# Altium schematic sheet EEM_connector_Magneto.SchDoc: EEM connector
size 420 x 297 mm; Author: G.Kasprowicz; CompanyName: WUT ISE; DrawnBy: G.Kasprowicz; Organization: WUT ISE; Address1: PW ISE; Address2: Nowowiejska 15/19 00-665 Warsaw; Address3: gkasprow@gmail.com; DocumentNumber: 3; Revision: 2; SheetNumber: 3; SheetTotal: 7; ModifiedBy: -; CheckedDate: -; Title2: & LVDS circuit; DivGrp: WUT ISE; Designer: G.Kasprowicz; ModifiedDate: -; ProjectName: Sensor Box
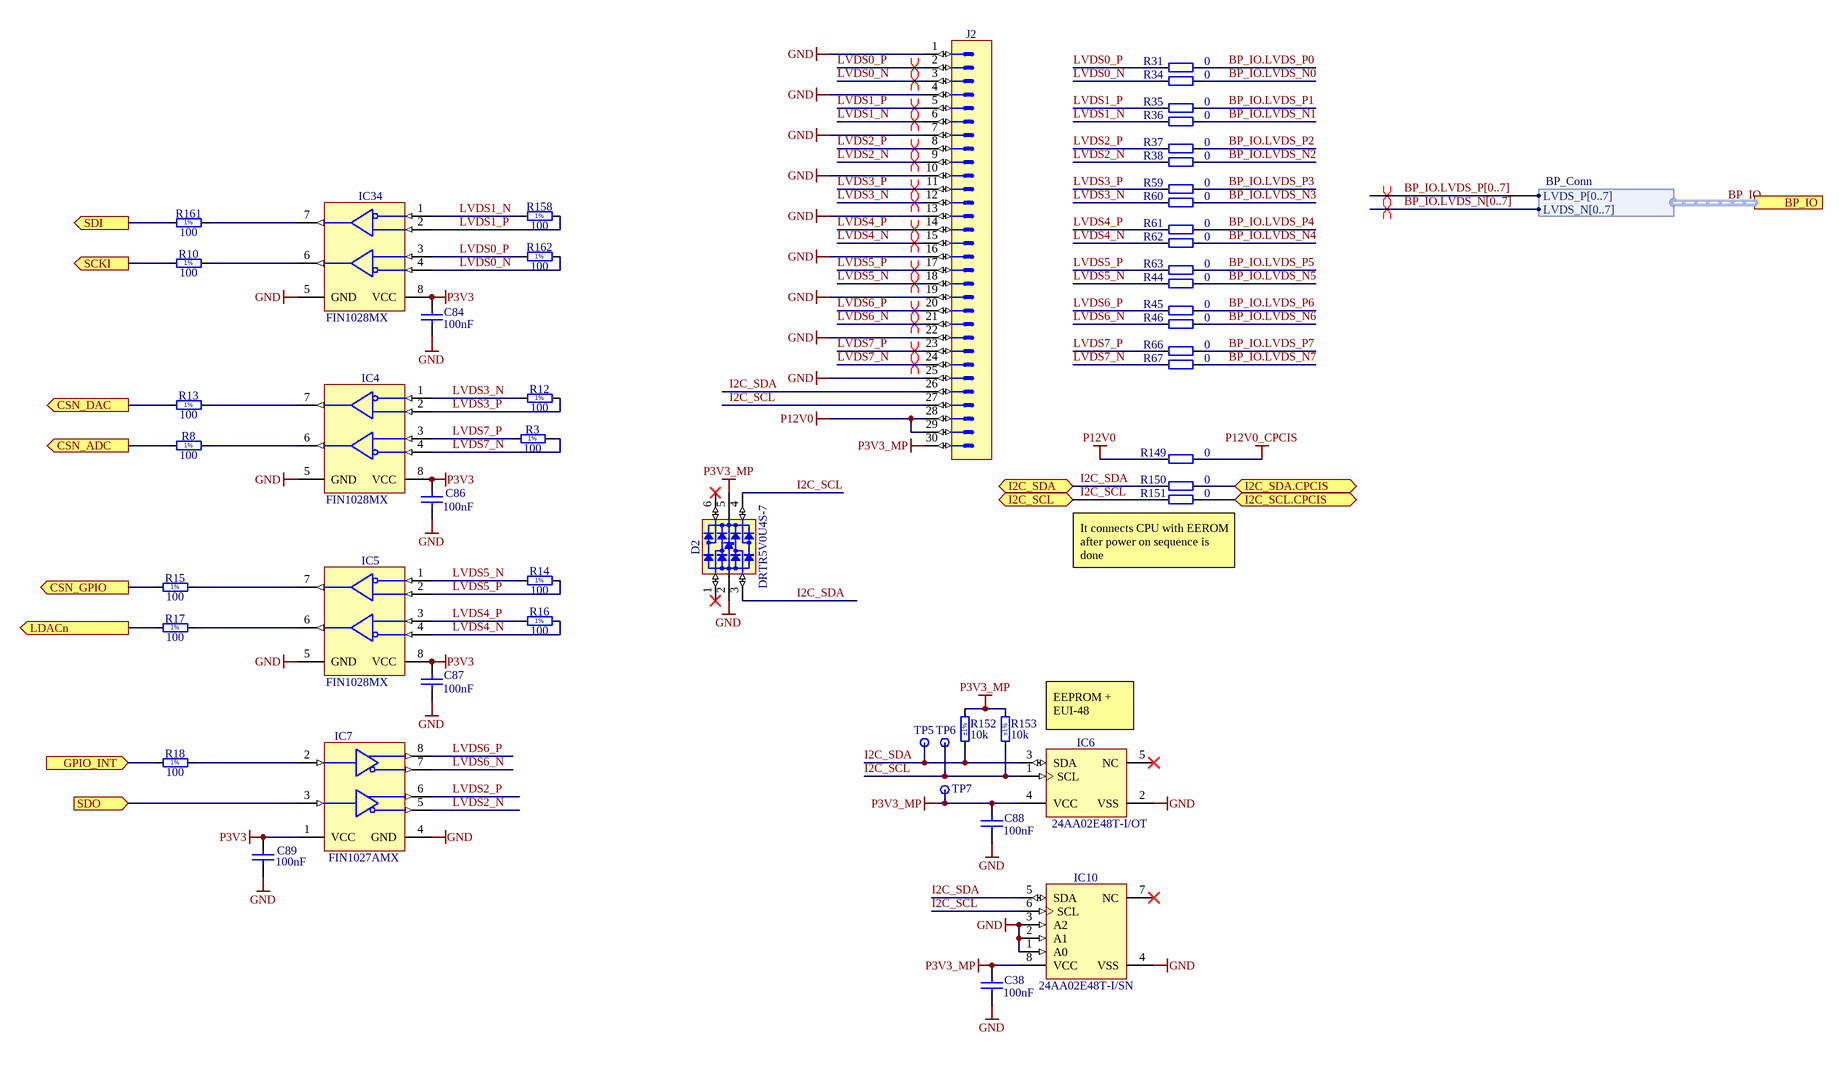
[diagram p0: EEM_connector_Magneto.SchDoc]

## Parts
C38  100nF  [CAPC1005X55N]
C84  100nF  [CAPC1005X55N]
C86  100nF  [CAPC1005X55N]
C87  100nF  [CAPC1005X55N]
C88  100nF  [CAPC1005X55N]
C89  100nF  [CAPC1005X55N]
D2  DRTR5V0U4S-7  [SOT65P210X110-6N]
IC4  FIN1028MX  [SOIC127P600X175-8N]
IC5  FIN1028MX  [SOIC127P600X175-8N]
IC6  24AA02E48T-I/OT  [SOT95P280X145-5N]
IC7  FIN1027AMX  [SOIC127P600X175-8N]
IC10  24AA02E48T-I/SN  [SOIC127P600X175-8N]
IC34  FIN1028MX  [SOIC127P600X175-8N]
J2  IDC  [3M_N2530-6002RB]  (value not drawn)
R3  100  [RESC1005X40N]
R8  100  [RESC1005X40N]
R10  100  [RESC1005X40N]
R12  100  [RESC1005X40N]
R13  100  [RESC1005X40N]
R14  100  [RESC1005X40N]
R15  100  [RESC1005X40N]
R16  100  [RESC1005X40N]
R17  100  [RESC1005X40N]
R18  100  [RESC1005X40N]
R31  0  [RESC1005X40N]
R34  0  [RESC1005X40N]
R35  0  [RESC1005X40N]
R36  0  [RESC1005X40N]
R37  0  [RESC1005X40N]
R38  0  [RESC1005X40N]
R44  0  [RESC1005X40N]
R45  0  [RESC1005X40N]
R46  0  [RESC1005X40N]
R59  0  [RESC1005X40N]
R60  0  [RESC1005X40N]
R61  0  [RESC1005X40N]
R62  0  [RESC1005X40N]
R63  0  [RESC1005X40N]
R66  0  [RESC1005X40N]
R67  0  [RESC1005X40N]
R149  0  [RESC2012X60N]
R150  0  [RESC1005X40N]
R151  0  [RESC1005X40N]
R152  10k  Tolerance: ±1%  [RESC1005X40N]
R153  10k  Tolerance: ±1%  [RESC1005X40N]
R158  100  [RESC1005X40N]
R161  100  [RESC1005X40N]
R162  100  [RESC1005X40N]
TP5  Test Point  [TPS127]  (value not drawn)  (no BOM)
TP6  Test Point  [TPS127]  (value not drawn)  (no BOM)
TP7  Test Point  [TPS127]  (value not drawn)  (no BOM)

## Ports
BP_IO (harness BP_Conn), CSN_ADC (out), CSN_DAC (out), CSN_GPIO (out), GPIO_INT (in), I2C_SCL (bidir), I2C_SCL.CPCIS (bidir), I2C_SDA (bidir), I2C_SDA.CPCIS (bidir), LDACn (out), SCKI (out), SDI (out), SDO (in)

## Harnesses
BP_Conn: LVDS_P[0..7], LVDS_N[0..7]

## Nets
GND: C38.1 C84.1 C86.1 C87.1 C88.1 C89.1 D2.2(GND) IC4.5(GND) IC5.5(GND) IC6.2(VSS) IC7.4(GND) IC10.1(A0) IC10.2(A1) IC10.3(A2) IC10.4(VSS) IC34.5(GND) J2.1 J2.4 J2.7 J2.10 J2.13 J2.16 J2.19 J2.22 J2.25
P3V3: C84.2 C86.2 C87.2 C89.2 IC4.8(VCC) IC5.8(VCC) IC7.1(VCC) IC34.8(VCC)
P3V3_MP: C38.2 C88.2 D2.5(VBUS) IC6.4(VCC) IC10.8(VCC) J2.30 R152.2 R153.2 TP7.1
P12V0: J2.28 J2.29 R149.1
P12V0_CPCIS: R149.2
BP_IO.LVDS_N0: R34.2
BP_IO.LVDS_N1: R36.2
BP_IO.LVDS_N2: R38.2
BP_IO.LVDS_N3: R60.2
BP_IO.LVDS_N4: R62.2
BP_IO.LVDS_N5: R44.2
BP_IO.LVDS_N6: R46.2
BP_IO.LVDS_N7: R67.2
BP_IO.LVDS_P0: R31.2
BP_IO.LVDS_P1: R35.2
BP_IO.LVDS_P2: R37.2
BP_IO.LVDS_P3: R59.2
BP_IO.LVDS_P4: R61.2
BP_IO.LVDS_P5: R63.2
BP_IO.LVDS_P6: R45.2
BP_IO.LVDS_P7: R66.2
CSN_ADC: R8.1 ; port CSN_ADC
CSN_DAC: R13.1 ; port CSN_DAC
CSN_GPIO: R15.1 ; port CSN_GPIO
GPIO_INT: R18.1 ; port GPIO_INT
I2C_SCL: D2.4(I/O3) IC6.1(SCL) IC10.6(SCL) J2.27 R151.1 R153.1 TP6.1 ; port I2C_SCL
I2C_SCL.CPCIS: R151.2 ; port I2C_SCL.CPCIS
I2C_SDA: D2.3(I/O2) IC6.3(SDA) IC10.5(SDA) J2.26 R150.1 R152.1 TP5.1 ; port I2C_SDA
I2C_SDA.CPCIS: R150.2 ; port I2C_SDA.CPCIS
LDACn: R17.1 ; port LDACn
LVDS0_N: IC34.4(RIN2-) J2.3 R34.1 R162.2
LVDS0_P: IC34.3(RIN2+) J2.2 R31.1 R162.1
LVDS1_N: IC34.1(RIN1-) J2.6 R36.1 R158.1
LVDS1_P: IC34.2(RIN1+) J2.5 R35.1 R158.2
LVDS2_N: IC7.5(DOUT-) J2.9 R38.1
LVDS2_P: IC7.6(DOUT+) J2.8 R37.1
LVDS3_N: IC4.1(RIN1-) J2.12 R12.1 R60.1
LVDS3_P: IC4.2(RIN1+) J2.11 R12.2 R59.1
LVDS4_N: IC5.4(RIN2-) J2.15 R16.2 R62.1
LVDS4_P: IC5.3(RIN2+) J2.14 R16.1 R61.1
LVDS5_N: IC5.1(RIN1-) J2.18 R14.1 R44.1
LVDS5_P: IC5.2(RIN1+) J2.17 R14.2 R63.1
LVDS6_N: IC7.7(DOUT-) J2.21 R46.1
LVDS6_P: IC7.8(DOUT+) J2.20 R45.1
LVDS7_N: IC4.4(RIN2-) J2.24 R3.2 R67.1
LVDS7_P: IC4.3(RIN2+) J2.23 R3.1 R66.1
SCKI: R10.1 ; port SCKI
SDI: R161.1 ; port SDI
SDO: IC7.3(DIN2RIN-) ; port SDO
NetIC4_6: IC4.6(ROUT2) R8.2
NetIC4_7: IC4.7(ROUT1) R13.2
NetIC5_6: IC5.6(ROUT2) R17.2
NetIC5_7: IC5.7(ROUT1) R15.2
NetIC7_2: IC7.2(DIN1) R18.2
NetIC34_6: IC34.6(ROUT2) R10.2
NetIC34_7: IC34.7(ROUT1) R161.2

Not connected (* = marked no-connect by the designer): D2 1(I/O1)* 6(I/O4)*; IC6 5(NC)*; IC10 7(NC)*

## Buses and harness runs
bus BP_IO.LVDS_N[0..7]
bus BP_IO.LVDS_P[0..7]
harness BP_IO = port BP_IO

## Layout directives
differential pair: (no net found under the mark), LVDS0_N, LVDS0_P, LVDS1_N, LVDS1_P, LVDS2_N, LVDS2_P, LVDS3_N, LVDS3_P, LVDS4_N, LVDS4_P, LVDS5_N, LVDS5_P, LVDS6_N, LVDS6_P, LVDS7_N, LVDS7_P

## Notes on the sheet
- (near R151) It connects CPU with EEROM after power on sequence is done
- EEPROM + EUI-48
- Project/Equipment
- Document
- Designer
- Drawn by
- Check.by
- Copyright WUT ISE 2020.
  This documentation describes Open Hardware and is licensed under the CERN OHL v.1.2. You may redistribute and modify this documentation under the terms of the CERN OHL v.1.2. (http://ohwr.org/CERNOHL). This documentation is distributed WITHOUT ANY EXPRESS OR IMPLIED WARRANTY, INCLUDING OF MERCHANTABILITY, SATISFACTORY QUALITY AND FITNESS FOR A PARTICULAR PURPOSE. Please see the CERN OHL v.1.2 for applicable conditions.
- Contact
- File
- Last Mod.
- Print Date
- Sheet
- Size
- A3
- of
- Rev
- (in symbol R0402_100R_1%_0.0625W_100PPM) 1%

## Library data of the parts
C38 C84 C86-C89 = CC0402_100NF_16V_10%_X5R: Non-polarised capacitor; Part Description: SMD Multilayer Chip Ceramic Capacitor; Manufacturer: GENERIC; Manufacturer1 Part Number: GRM155R61C104KA88D; Voltage: 16V; TC: X5R; Tolerance: ±10%; Part Number: CC0402_100NF_16V_10%_X5R; Component Kind: Standard; Component Type: Standard; Pin Count: 2; Value: 100nF; Status: None; Manufacturer Part Number: CC0402_100NF_16V_10%_X5R; Case: 0402; Mounted: Yes; Socket: No; SMD: Yes; Sense: No; Manufacturer1 Example: MURATA; Manufacturer1 ComponentHeight: 0.55mm; HelpURL: \\cern.ch\dfs\Applications\Altium\Datasheets\CC0402_X5R_MURATA_GRM.pdf; Author: CERN DEM JLC; CreateDate: 10.12.2013; LatestRevisionDate: 10.12.2013
D2 = D_TVS_DRTR5V0U4S-7: Integrated Quad Ultra-Low Capacitance ESD Protection; Part Description: Integrated Quad Ultra-Low Capacitance ESD (±8kV) Protection; Manufacturer1: DIODES; PressFit: No; Bonding: No; Status Comment: Active; Part Number: DRTR5V0U4S-7; Component Kind: Standard; Component Type: Standard; Device: DRTR5V0U4S-7; PackageDescription: SOT363, SC70-6, 0.65mm Pitch; 6 Pin, 1.25mm W X 2.00mm L X 1.10mm H body, IPC Medium Density; Status: Active; Manufacturer1 Part Number: DRTR5V0U4S-7; Pin Count: 6; Case: SOT363; Mounted: Yes; Socket: No; SMD: Yes; Sense: No; ComponentHeight: 1.1mm; HelpURL: \\cern.ch\dfs\Applications\Altium\Datasheets\PRTR5V0U4Y.pdf; Author: GK; CreateDate: 24.01.2017; LatestRevisionDate: 14.09.2020
IC4 IC5 IC34 = IFC_FIN1028: 3.3V LVDS 2-Bit High-Speed Differential Reciever; Manufacturer1: ON Semiconductor; PressFit: No; Bonding: No; Part Number: FIN1028MX; Component Kind: Standard; Component Type: Standard; Device: FIN1028MX; PackageDescription: SOIC 8, Pitch 1.27mm - Body 4x5mm, IPC Medium Density; Part Description: 3.3V LVDS 2-Bit High-Speed Differential Reciever; Manufacturer1 Part Number: FIN1028MX; Pin Count: 8; Case: SOIC8; Mounted: Yes; Socket: No; SMD: Yes; Sense: No; ComponentHeight: 0.8mm; Author: GK; HelpURL: \\cern.ch\dfs\Applications\Altium\Datasheets\FIN1101K8X.pdf; CreateDate: 08/11/2016; LatestRevisionDate: 08/11/2016
IC6 = 24AA02E48T-I/OT: 1.7V-5.5V, 2K I2C Serial EEPROM With EUI-48 Node Identity; Manufacturer: MICROCHIP TECHNOLOGY; PressFit: No; Bonding: No; Part Number: 24AA02E48T-I/OT; Component Kind: Standard; Component Type: Standard; Device: 24AA02E48T-I/OT; PackageDescription: SOT, 0.95mm pitch; 5 pin, 1.60mm W X 2.90mm L X 1.45mm H body, IPC Medium Density; Part Description: 1.7V-5.5V, 2K I2C Serial EEPROM With EUI-48 Node Identity; Manufacturer Part Number: 24AA02E48T-I/OT; Pin Count: 5; Case: SOT23-5; Mounted: Yes; Socket: No; SMD: Yes; Sense: No; ComponentHeight: 1.45mm; HelpURL: \\cern.ch\dfs\Applications\Altium\Datasheets\24AA02E48T-I-OT.pdf; Author: CERN DEM MR; CreateDate: 31.03.2016; LatestRevisionDate: 31.03.2016
IC7 = IFC_FIN1027A: 3.3V LVDS, 2-Bit, High-Speed, Differential Driver; Manufacturer1: ON Semiconductor; PressFit: No; Bonding: No; Part Number: FIN1027AMX; Component Kind: Standard; Component Type: Standard; Device: FIN1027AMX; PackageDescription: SOIC 8, Pitch 1.27mm - Body 4x5mm, IPC Medium Density; Part Description: 3.3V LVDS, 2-Bit, High-Speed, Differential Driver; Manufacturer1 Part Number: FIN1027AMX; Pin Count: 8; Case: SOIC8; Mounted: Yes; Socket: No; SMD: Yes; Sense: No; ComponentHeight: 0.8mm; Author: GK; HelpURL: \\cern.ch\dfs\Applications\Altium\Datasheets\FIN1101K8X.pdf; CreateDate: 08/11/2016; LatestRevisionDate: 08/11/2016
IC10 = 24AA025E48-I/SN: 1.7V-5.5V, 2K I2C™ Serial EEPROMs with EUI-48™ Node Identity; Manufacturer1: MICROCHIP TECHNOLOGY; PressFit: No; Bonding: No; Part Number: 24AA02E48T-I/SN; Component Kind: Standard; Component Type: Standard; Device: 24AA02E48T-I/SN; PackageDescription: SOIC 8, Pitch 1.27mm - Body 4x5mm, IPC Medium Density; Part Description: 1.7V-5.5V, 2K I2C™ Serial EEPROMs with EUI-48™ Node Identity; Manufacturer1 Part Number: 24AA02E48T-I/SN; Pin Count: 8; Case: SOIC8; Mounted: Yes; Socket: No; SMD: Yes; Sense: No; ComponentHeight: 1.75mm; HelpURL: \\cern.ch\dfs\Applications\Altium\Datasheets\24AA025E48-I-SN.pdf; Author: CERN DEM MR; CreateDate: 19.07.2016; LatestRevisionDate: 19.07.2016
J2 = 3M_N2530-6002RB: Connector 30 Male; Part Description: 30 Contacts - Straight .100'' x .100'' Low Profile Four-Wall Header, 2500 Series; Manufacturer: 3M; PressFit: No; Part Number: 3M_N2530-6002RB; Component Kind: Standard; Component Type: Standard; Pin Count: 30; Family: Header 30; Mounted: Yes; Socket: No; SMD: No; Sense: No; Status: None; Manufacturer Part Number: N2530-6002RB; ComponentHeight: 10.03mm; HelpURL: \\cern.ch\dfs\Applications\Altium\Datasheets\3M_N2530-6002RB.pdf; Author: CERN DEM JLC; CreateDate: 11.02.2009; LatestRevisionDate: 11.08.2009
R3 R8 R10 R12-R18 R158 R161 R162 = R0402_100R_1%_0.0625W_100PPM: Resistor - 1%; Part Description: General Purpose Thick Film Chip Resistor; Manufacturer: GENERIC; Manufacturer1: Vishay; Manufacturer1 Part Number: RCA0402100RFKED; TC: ±100ppm/°C; PressFit: No; Part Number: R0402_100R_1%_0.0625W_100PPM; Component Kind: Standard; Component Type: Standard; Pin Count: 2; Value: 100; Status: Not Recommended; Power: 0.0625W; Tolerance: ±1%; Manufacturer Part Number: R0402_100R_1%_0.0625W_100PPM; Case: 0402; Mounted: Yes; Sense: No; Socket: No; SMD: Yes; Manufacturer1 ComponentHeight: 0.4mm; HelpURL: \\cern.ch\dfs\Applications\Altium\Datasheets\R0402_Phycomp_RC0402.pdf; Author: CERN DEM JLC; CreateDate: 03.12.2007; LatestRevisionDate: 17.10.2012
R31 R34-R38 R44-R46 R59-R63 R66 R67 R150 R151 = R0402_0R_JUMPER: Resistor; Part Description: 1A (0.05R Max DC Resistance) Zero Ohm Jumper; Manufacturer: GENERIC; Manufacturer1: Vishay; Manufacturer1 Part Number: CRCW04020000Z0EDC; PressFit: No; Part Number: R0402_0R_JUMPER; Component Kind: Standard; Component Type: Standard; Pin Count: 2; Value: 0; Status: Not Recommended; Manufacturer Part Number: R0402_0R_JUMPER; Case: 0402; Mounted: Yes; Sense: No; Socket: No; SMD: Yes; Manufacturer1 ComponentHeight: 0.4mm; HelpURL: \\cern.ch\dfs\Applications\Altium\Datasheets\R0402_Phycomp_RC0402.pdf; Author: CERN DEM JLC; CreateDate: 03.12.2007; LatestRevisionDate: 17.10.2012
R149 = R0805_0R_JUMPER: Resistor; Part Description: 2A (0.05R Max DC Resistance) Zero Ohm Jumper; Manufacturer: GENERIC; Manufacturer1: Vishay; Manufacturer1 Part Number: RCA08050000ZSEA; PressFit: No; Part Number: R0805_0R_JUMPER; Component Kind: Standard; Component Type: Standard; Pin Count: 2; Value: 0; Status: Preferred; Manufacturer Part Number: R0805_0R_JUMPER; Case: 0805; Mounted: Yes; Sense: No; Socket: No; SMD: Yes; Manufacturer1 ComponentHeight: 0.6mm; HelpURL: \\cern.ch\dfs\Applications\Altium\Datasheets\R0805_NIC_NRC.pdf; Author: CERN DEM JLC; CreateDate: 03.12.2007; LatestRevisionDate: 13.03.2008
R152 R153 = R0402_10K_1%_0.0625W_100PPM: Resistor - 1%; Part Description: General Purpose Thick Film Chip Resistor; Manufacturer: GENERIC; Manufacturer1: Vishay; Manufacturer1 Part Number: RCA040210K0FKED; TC: ±100ppm/°C; PressFit: No; Part Number: R0402_10K_1%_0.0625W_100PPM; Component Kind: Standard; Component Type: Standard; Pin Count: 2; Value: 10k; Status: Not Recommended; Power: 0.0625W; Manufacturer Part Number: R0402_10K_1%_0.0625W_100PPM; Case: 0402; Mounted: Yes; Sense: No; Socket: No; SMD: Yes; Manufacturer1 ComponentHeight: 0.4mm; HelpURL: \\cern.ch\dfs\Applications\Altium\Datasheets\R0402_Phycomp_RC0402.pdf; Author: CERN DEM JLC; CreateDate: 03.12.2007; LatestRevisionDate: 17.10.2012
TP5-TP7 = SMD_PAD_1.27X1.27MM: Part Description: 1.27mm x 1.27mm PCB Copper Area (SMD Test Point); Mounted: No; Part Number: SMD_PAD_1.27X1.27MM; Component Type: Standard (No BOM); Pin Count: 1; Family: Test Point; Socket: No; SMD: Yes; Sense: No; Status: None; ComponentHeight: 0mm; HelpURL: Undefined; Author: CERN DEM JLC; CreateDate: 12.01.2008; LatestRevisionDate: 12.01.2008; PackageDescription: 1.27mm x 1.27mm PCB Copper Area (SMD Test Point)